# Altium schematic sheet SampleProject.SchDoc
size A4
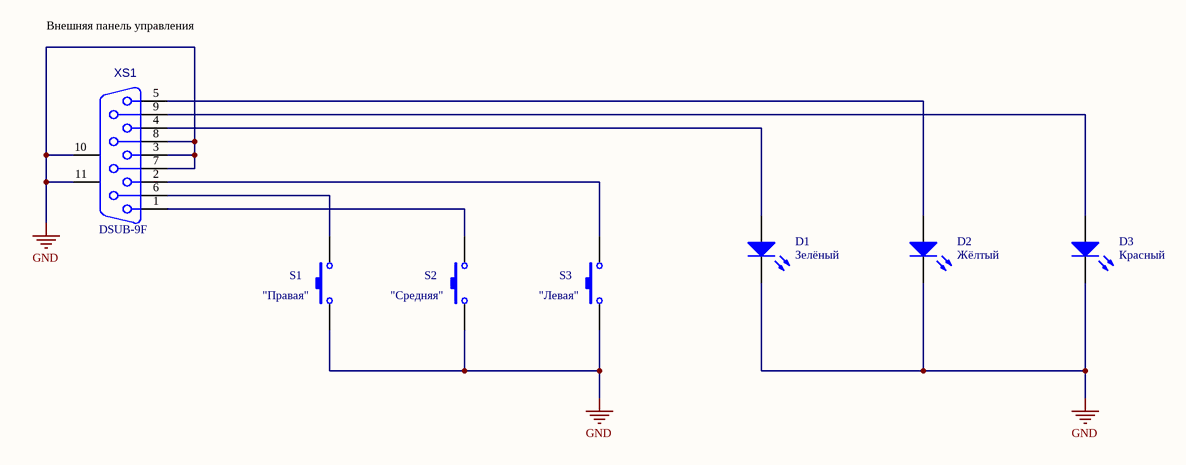
[diagram p0: SampleProject.SchDoc]

## Parts
D1  value Зелёный  [LED_5MM_GREEN_1C-2A]  (hidden comment: Светодиод  выводной 5mm  Зелёный)
D2  value Жёлтый  [LED_5MM_YELLOW_1C-2A]  (hidden comment: Светодиод  выводной 5mm  Жёлтый)
D3  value Красный  [LED_5MM_RED_1C-2A]  (hidden comment: Светодиод  выводной 5mm  Красный)
S1  Name: "Правая"  [TACT 12x12-5.0 DIP]  (hidden comment: Кнопка TACT 12x12-5.0)
S2  Name: "Средняя"  [TACT 12x12-5.0 DIP]  (hidden comment: Кнопка TACT 12x12-5.0)
S3  Name: "Левая"  [TACT 12x12-5.0 DIP]  (hidden comment: Кнопка TACT 12x12-5.0)
XS1  Name: Внешняя панель управления  [DSUB-9F]  (hidden comment: Разъём DSUB-9F)

## Nets
GND: D1.1(C) D2.1(C) D3.1(C) S1.1 S2.1 S3.1 XS1.3 XS1.7 XS1.8 XS1.10(MH1) XS1.11(MH2)
NetD1_2: D1.2(A) XS1.4
NetD2_2: D2.2(A) XS1.5
NetD3_2: D3.2(A) XS1.9
NetS1_2: S1.2 XS1.6
NetS2_2: S2.2 XS1.1
NetS3_2: S3.2 XS1.2

## Library data of the parts
D1 = LED: Typical LED; Voltage: 3V; Current: 20mA; Name: Индикатор "Питание"; ComponentLink1Description: Сайт Производителя; ComponentLink2Description: Datasheet; Family: Светодиод; Package: выводной 5mm
D2 = LED: Typical LED; Voltage: 3V; Current: 20mA; Name: Индикатор "Внимание"; ComponentLink1Description: Сайт Производителя; ComponentLink2Description: Datasheet; Family: Светодиод; Package: выводной 5mm
D3 = LED: Typical LED; Voltage: 3V; Current: 20mA; Name: Индикатор "Ошибка"; ComponentLink1Description: Сайт Производителя; ComponentLink2Description: Datasheet; Family: Светодиод; Package: выводной 5mm
S1-S3 = SW-PB: Push-Button (TACT); ComponentLink1Description: Сайт Производителя; ComponentLink2Description: Datasheet; Family: Кнопка; Device: TACT 12x12-5.0
XS1 = DSUB-9F: DSub-9 pin female 90*; ComponentLink1Description: Сайт Производителя; ComponentLink2Description: Datasheet; Family: Разъём; ComponentLink3Description: Где купить?; Device: DSUB-9F